# Altium schematic sheet Sheet2.SchDoc
size A4
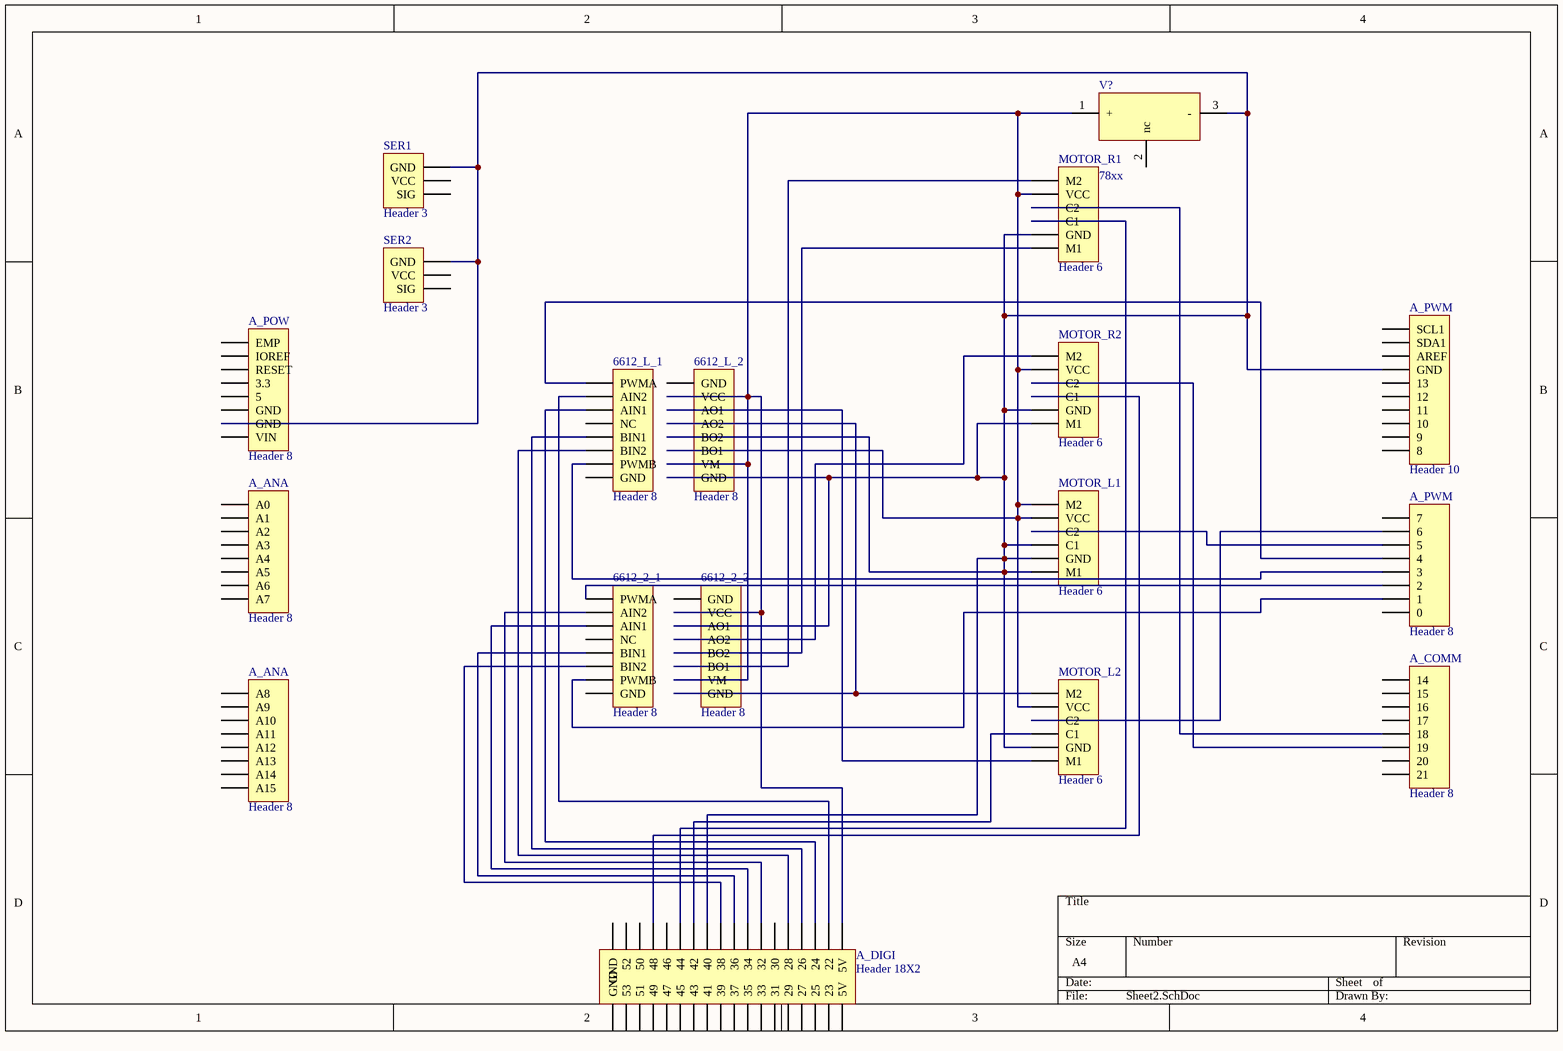
[diagram p0: Sheet2.SchDoc]

## Parts
(Parts that share a designator on the sheet are numbered #1, #2 ... from top to bottom, then left to right.)
6612_2_1  Header 8  [HDR1X8]
6612_2_2  Header 8  [HDR1X8]
6612_L_1  Header 8  [HDR1X8]
6612_L_2  Header 8  [HDR1X8]
A_ANA#1  Header 8  [HDR1X8]
A_ANA#2  Header 8  [HDR1X8]
A_COMM  Header 8  [HDR1X8]
A_DIGI  Header 18X2  [HDR2X18]
A_POW  Header 8  [HDR1X8]
A_PWM#1  Header 10  [HDR1X10]
A_PWM#2  Header 8  [HDR1X8]
MOTOR_L1  Header 6  [HDR1X6]
MOTOR_L2  Header 6  [HDR1X6]
MOTOR_R1  Header 6  [HDR1X6]
MOTOR_R2  Header 6  [HDR1X6]
SER1  Header 3  [HDR1X3]
SER2  Header 3  [HDR1X3]
V?  78xx  [TO252]

## Nets
Net6612_2_1_1: 6612_2_1.1(PWMA) A_PWM#2.6(2)
Net6612_2_1_2: 6612_2_1.2(AIN2) A_DIGI.13(32)
Net6612_2_1_3: 6612_2_1.3(AIN1) A_DIGI.15(34)
Net6612_2_1_5: 6612_2_1.5(BIN1) A_DIGI.17(36)
Net6612_2_1_6: 6612_2_1.6(BIN2) A_DIGI.19(38)
Net6612_2_1_7: 6612_2_1.7(PWMB) A_PWM#2.7(1)
Net6612_2_2_2: 6612_2_2.2(VCC) 6612_2_2.7(VM) 6612_L_2.2(VCC) 6612_L_2.6(BO1) 6612_L_2.7(VM) A_DIGI.1(5V) MOTOR_L1.1(M2) MOTOR_L1.2(VCC) MOTOR_L2.2(VCC) MOTOR_R1.2(VCC) MOTOR_R2.2(VCC) V?.1(+)
Net6612_2_2_3: 6612_2_2.3(AO1) 6612_L_2.5(BO2) 6612_L_2.8(GND) A_DIGI.21(40) A_POW.7(GND) A_PWM#1.4(GND) MOTOR_L1.4(C1) MOTOR_L1.5(GND) MOTOR_L1.6(M1) MOTOR_L2.5(GND) MOTOR_R1.5(GND) MOTOR_R2.5(GND) MOTOR_R2.6(M1) SER1.3(GND) SER2.3(GND) V?.3(-)
Net6612_2_2_4: 6612_2_2.4(AO2) MOTOR_R2.1(M2)
Net6612_2_2_5: 6612_2_2.5(BO2) MOTOR_R1.6(M1)
Net6612_2_2_6: 6612_2_2.6(BO1) MOTOR_R1.1(M2)
Net6612_2_2_8: 6612_2_2.8(GND) 6612_L_2.4(AO2) MOTOR_L2.1(M2)
Net6612_L_1_1: 6612_L_1.1(PWMA) A_PWM#2.4
Net6612_L_1_2: 6612_L_1.2(AIN2) A_DIGI.3(22)
Net6612_L_1_3: 6612_L_1.3(AIN1) A_DIGI.5(24)
Net6612_L_1_5: 6612_L_1.5(BIN1) A_DIGI.7(26)
Net6612_L_1_6: 6612_L_1.6(BIN2) A_DIGI.9(28)
Net6612_L_1_7: 6612_L_1.7(PWMB) A_PWM#2.5(3)
Net6612_L_2_3: 6612_L_2.3(AO1) MOTOR_L2.6(M1)
NetA_COMM_5: A_COMM.5(18) MOTOR_R1.3(C2)
NetA_COMM_6: A_COMM.6(19) MOTOR_R2.3(C2)
NetA_DIGI_23: A_DIGI.23(42) MOTOR_L2.4(C1)
NetA_DIGI_25: A_DIGI.25(44) MOTOR_R1.4(C1)
NetA_DIGI_29: A_DIGI.29(48) MOTOR_R2.4(C1)
NetA_PWM#2_2: A_PWM#2.2(6) MOTOR_L2.3(C2)
NetA_PWM#2_3: A_PWM#2.3(5) MOTOR_L1.3(C2)

Not connected (* = marked no-connect by the designer): 6612_2_1 4(NC) 8(GND); 6612_2_2 1(GND); 6612_L_1 4(NC) 8(GND); 6612_L_2 1(GND); A_ANA#1 1(A0) 2(A1) 3(A2) 4(A3) 5(A4) 6(A5) 7(A6) 8(A7); A_ANA#2 1(A8) 2(A9) 3(A10) 4(A11) 5(A12) 6(A13) 7(A14) 8(A15); A_COMM 1(14) 2(15) 3(16) 4(17) 7(20) 8(21); A_DIGI 2(5V) 4(23) 6(25) 8(27) 10(29) 11(30) 12(31) 14(33) 16(35) 18(37) 20(39) 22(41) 24(43) 26(45) 27(46) 28(47) 30(49) 31(50) 32(51) 33(52) 34(53) 35(GND) 36(GND); A_POW 1(EMP) 2(IOREF) 3(RESET) 4(3.3) 5 6(GND) 8(VIN); A_PWM#1 1(SCL1) 2(SDA1) 3(AREF) 5(13) 6(12) 7(11) 8(10) 9 10(8); A_PWM#2 1(7) 8(0); SER1 1(SIG) 2(VCC); SER2 1(SIG) 2(VCC); V? 2(nc)

## Library data of the parts
6612_2_1 6612_2_2 6612_L_1 6612_L_2 A_ANA#1 A_ANA#2 A_COMM A_POW A_PWM#2 = Header 8: Header, 8-Pin; LatestRevisionDate: 17-Jul-2002; LatestRevisionNote: Re-released for DXP Platform.; Publisher: Altium Limited
A_DIGI = Header 18X2: Header, 18-Pin, Dual row; LatestRevisionDate: 17-Jul-2002; LatestRevisionNote: Re-released for DXP Platform.; Publisher: Altium Limited
A_PWM#1 = Header 10: Header, 10-Pin; LatestRevisionDate: 17-Jul-2002; LatestRevisionNote: Re-released for DXP Platform.; Publisher: Altium Limited
MOTOR_L1 MOTOR_L2 MOTOR_R1 MOTOR_R2 = Header 6: Header, 6-Pin; LatestRevisionDate: 17-Jul-2002; LatestRevisionNote: Re-released for DXP Platform.; Publisher: Altium Limited
SER1 SER2 = Header 3: Header, 3-Pin; LatestRevisionDate: 17-Jul-2002; LatestRevisionNote: Re-released for DXP Platform.; Publisher: Altium Limited
V? = 78xx: LM78XX系列线性稳压芯片; BOM名称: 线性稳压芯片; 优秀评价可免费更新: 联系淘宝ID：黄晶宝石，获取更新版封装库; 卖家免费技术支持，联系售后: 唯一出售店铺网址https://shop463601444.taobao.com; 封装库来自淘宝卖家 ID：黄晶宝石: 其他店铺购入均为假冒，请立即申请退款，本店奖励2~5元现金